# Altium schematic sheet EMG_Sensor_Board.SchDoc: EMG Sensor Board
size A3; Date: 15.05.2024; Author: Robin Geißler; CompanyName: Fraunhofer EMFT; DrawnBy: Robin Geißler; Revision: 1.1.; SheetNumber: 1; SheetTotal: 6
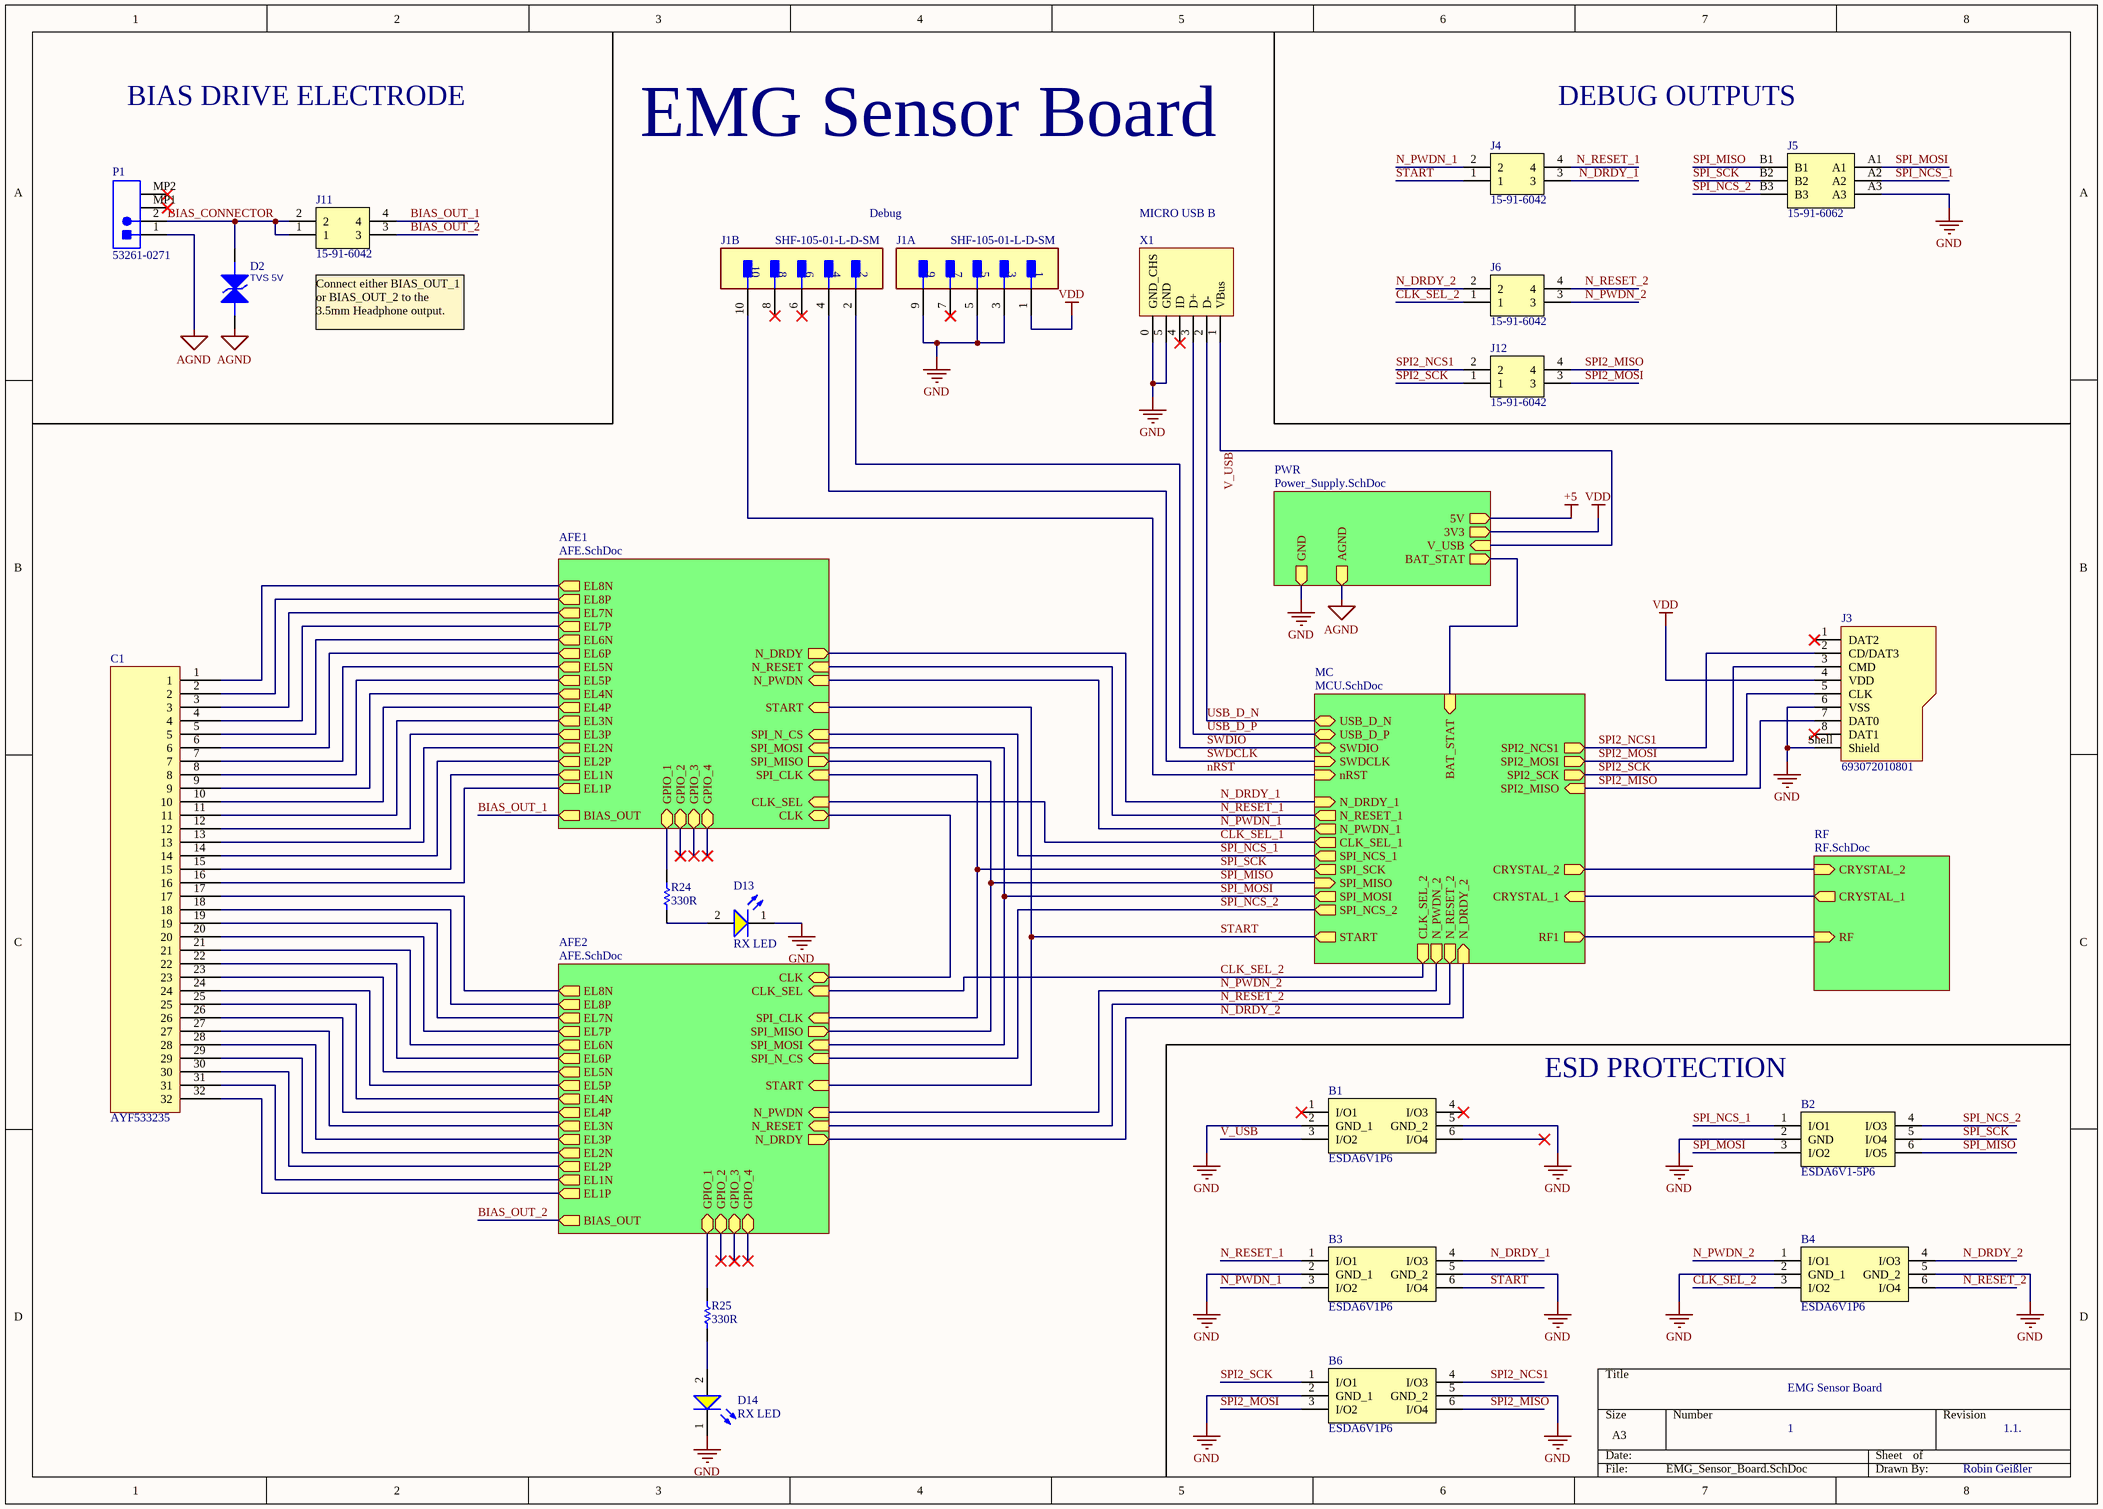
[diagram p0: EMG_Sensor_Board.SchDoc]

## Parts
B1  ESDA6V1P6  [ESDA6V1P6]
B2  ESDA6V1-5P6  [ESDA6V15P6]
B3  ESDA6V1P6  [ESDA6V1P6]
B4  ESDA6V1P6  [ESDA6V1P6]
B6  ESDA6V1P6  [ESDA6V1P6]
C1  AYF533235  [AYF533235]
D2  TVS 5V  [C-1608 [0603]-N]
D13  RX LED  [WL-SMCW_0603_150060xx75000]
D14  RX LED  [WL-SMCW_0603_150060xx75000]
J1  SHF-105-01-L-D-SM  [FP-SHF-105-01-L-D-SM-MFG]  (parts A,B of 2)
J3  693072010801  [693072010801]
J4  15-91-6042  [15916042]
J5  15-91-6062  [15916062]
J6  15-91-6042  [15916042]
J11  15-91-6042  [15916042]
J12  15-91-6042  [15916042]
P1  53261-0271  [MOLX-53261-0271_V]
R24  330R  [RESC1608X55X30LL15T15]
R25  330R  [RESC1608X55X30LL15T15]
X1  MICRO USB B  [Micro USB B]

## Sub-sheets
AFE1 = AFE.SchDoc: SPI_MISO (out), SPI_N_CS (in), SPI_CLK (in), N_DRDY (out), CLK (bidir), CLK_SEL (in), GPIO_1 (bidir), GPIO_2 (bidir), GPIO_3 (bidir), GPIO_4 (bidir), START (in), N_RESET (in), N_PWDN (in), EL1P (out), EL1N (out), EL2P (out), EL2N (out), EL3P (out), EL3N (out), EL4P (out), EL4N (out), EL5P (out), EL5N (out), EL6P (out), EL6N (out), EL7P (out), EL7N (out), EL8P (out), EL8N (out), BIAS_OUT (out), SPI_MOSI (in)
AFE2 = AFE.SchDoc: SPI_MISO (out), SPI_N_CS (in), SPI_CLK (in), N_DRDY (out), CLK (bidir), CLK_SEL (in), GPIO_1 (bidir), GPIO_2 (bidir), GPIO_3 (bidir), GPIO_4 (bidir), START (in), N_RESET (in), N_PWDN (in), EL1P (out), EL1N (out), EL2P (out), EL2N (out), EL3P (out), EL3N (out), EL4P (out), EL4N (out), EL5P (out), EL5N (out), EL6P (out), EL6N (out), EL7P (out), EL7N (out), EL8P (out), EL8N (out), BIAS_OUT (out), SPI_MOSI (in)
MC = MCU.SchDoc: SWDIO (bidir), SWDCLK (in), nRST (in), SPI_SCK (out), SPI_MISO (in), SPI_MOSI (out), SPI_NCS_1 (out), SPI_NCS_2 (out), USB_D_P (bidir), USB_D_N (bidir), RF1 (out), START (out), N_DRDY_1 (in), N_RESET_1 (out), N_PWDN_1 (out), N_DRDY_2 (in), N_RESET_2 (out), N_PWDN_2 (out), CLK_SEL_1 (out), CLK_SEL_2 (out), CRYSTAL_2 (out), CRYSTAL_1 (in), BAT_STAT (in), SPI2_MOSI (out), SPI2_MISO (in), SPI2_SCK (out), SPI2_NCS1 (out)
PWR = Power_Supply.SchDoc: V_USB (in), BAT_STAT (out), 5V (out), 3V3 (out), GND (out), AGND (out)
RF = RF.SchDoc: RF (in), CRYSTAL_1 (out), CRYSTAL_2 (in)

## Nets
+5: sheet PWR/5V
AGND: D2.2(ANODE) P1.1 ; sheet PWR/AGND
GND: B1.2(GND_1) B1.5(GND_2) B2.2(GND) B3.2(GND_1) B3.5(GND_2) B4.2(GND_1) B4.5(GND_2) B6.2(GND_1) B6.5(GND_2) D13.1(K) D14.1(K) J1.3 J1.5 J1.9 J3.6(VSS) J3.Shell(Shield) J5.A3 X1.0(GND_CHS) X1.5(GND) ; sheet PWR/GND
VDD: J1.1 J3.4(VDD) ; sheet PWR/3V3
BIAS_CONNECTOR: D2.1(CATHODE) J11.1 J11.2 P1.2
BIAS_OUT_1: J11.4 ; sheet AFE1/BIAS_OUT
BIAS_OUT_2: J11.3 ; sheet AFE2/BIAS_OUT
CLK_SEL_1: sheet MC/CLK_SEL_1, sheet AFE1/CLK_SEL
CLK_SEL_2: B4.3(I/O2) J6.1 ; sheet MC/CLK_SEL_2, sheet AFE2/CLK_SEL
N_DRDY_1: B3.4(I/O3) J4.3 ; sheet MC/N_DRDY_1, sheet AFE1/N_DRDY
N_DRDY_2: B4.4(I/O3) J6.2 ; sheet MC/N_DRDY_2, sheet AFE2/N_DRDY
N_PWDN_1: B3.3(I/O2) J4.2 ; sheet MC/N_PWDN_1, sheet AFE1/N_PWDN
N_PWDN_2: B4.1(I/O1) J6.3 ; sheet MC/N_PWDN_2, sheet AFE2/N_PWDN
N_RESET_1: B3.1(I/O1) J4.4 ; sheet MC/N_RESET_1, sheet AFE1/N_RESET
N_RESET_2: B4.6(I/O4) J6.4 ; sheet MC/N_RESET_2, sheet AFE2/N_RESET
nRST: J1.10 ; sheet MC/nRST
SPI2_MISO: B6.6(I/O4) J3.7(DAT0) J12.4 ; sheet MC/SPI2_MISO
SPI2_MOSI: B6.3(I/O2) J3.3(CMD) J12.3 ; sheet MC/SPI2_MOSI
SPI2_NCS1: B6.4(I/O3) J3.2(CD/DAT3) J12.2 ; sheet MC/SPI2_NCS1
SPI2_SCK: B6.1(I/O1) J3.5(CLK) J12.1 ; sheet MC/SPI2_SCK
SPI_MISO: B2.6(I/O5) J5.B1 ; sheet MC/SPI_MISO, sheet AFE1/SPI_MISO, sheet AFE2/SPI_MISO
SPI_MOSI: B2.3(I/O2) J5.A1 ; sheet MC/SPI_MOSI, sheet AFE1/SPI_MOSI, sheet AFE2/SPI_MOSI
SPI_NCS_1: B2.1(I/O1) J5.A2 ; sheet MC/SPI_NCS_1, sheet AFE1/SPI_N_CS
SPI_NCS_2: B2.4(I/O3) J5.B3 ; sheet MC/SPI_NCS_2, sheet AFE2/SPI_N_CS
SPI_SCK: B2.5(I/O4) J5.B2 ; sheet MC/SPI_SCK, sheet AFE1/SPI_CLK, sheet AFE2/SPI_CLK
START: B3.6(I/O4) J4.1 ; sheet MC/START, sheet AFE1/START, sheet AFE2/START
SWDCLK: J1.4 ; sheet MC/SWDCLK
SWDIO: J1.2 ; sheet MC/SWDIO
USB_D_N: X1.2(D-) ; sheet MC/USB_D_N
USB_D_P: X1.3(D+) ; sheet MC/USB_D_P
V_USB: B1.3(I/O2) X1.1(VBus) ; sheet PWR/V_USB
NetC1_1: C1.1 ; sheet AFE1/EL8N
NetC1_2: C1.2 ; sheet AFE1/EL8P
NetC1_3: C1.3 ; sheet AFE1/EL7N
NetC1_4: C1.4 ; sheet AFE1/EL7P
NetC1_5: C1.5 ; sheet AFE1/EL6N
NetC1_6: C1.6 ; sheet AFE1/EL6P
NetC1_7: C1.7 ; sheet AFE1/EL5N
NetC1_8: C1.8 ; sheet AFE1/EL5P
NetC1_9: C1.9 ; sheet AFE1/EL4N
NetC1_10: C1.10 ; sheet AFE1/EL4P
NetC1_11: C1.11 ; sheet AFE1/EL3N
NetC1_12: C1.12 ; sheet AFE1/EL3P
NetC1_13: C1.13 ; sheet AFE1/EL2N
NetC1_14: C1.14 ; sheet AFE1/EL2P
NetC1_15: C1.15 ; sheet AFE1/EL1N
NetC1_16: C1.16 ; sheet AFE1/EL1P
NetC1_17: C1.17 ; sheet AFE2/EL8N
NetC1_18: C1.18 ; sheet AFE2/EL8P
NetC1_19: C1.19 ; sheet AFE2/EL7N
NetC1_20: C1.20 ; sheet AFE2/EL7P
NetC1_21: C1.21 ; sheet AFE2/EL6N
NetC1_22: C1.22 ; sheet AFE2/EL6P
NetC1_23: C1.23 ; sheet AFE2/EL5N
NetC1_24: C1.24 ; sheet AFE2/EL5P
NetC1_25: C1.25 ; sheet AFE2/EL4N
NetC1_26: C1.26 ; sheet AFE2/EL4P
NetC1_27: C1.27 ; sheet AFE2/EL3N
NetC1_28: C1.28 ; sheet AFE2/EL3P
NetC1_29: C1.29 ; sheet AFE2/EL2N
NetC1_30: C1.30 ; sheet AFE2/EL2P
NetC1_31: C1.31 ; sheet AFE2/EL1N
NetC1_32: C1.32 ; sheet AFE2/EL1P
NetD13_2: D13.2(A) R24.1
NetD14_2: D14.2(A) R25.2
NetR24_2: R24.2 ; sheet AFE1/GPIO_1
NetR25_1: R25.1 ; sheet AFE2/GPIO_1
(unnamed): sheet MC/RF1, sheet RF/RF
(unnamed): sheet MC/CRYSTAL_2, sheet RF/CRYSTAL_2
(unnamed): sheet MC/CRYSTAL_1, sheet RF/CRYSTAL_1
(unnamed): sheet MC/BAT_STAT, sheet PWR/BAT_STAT
(unnamed): sheet AFE1/CLK, sheet AFE2/CLK

Not connected (* = marked no-connect by the designer): B1 1(I/O1)* 4(I/O3)* 6(I/O4)*; J1 6* 7* 8*; J3 1(DAT2)* 8(DAT1)*; P1 MP1* MP2*; X1 4(ID)*

## Notes on the sheet
- BIAS DRIVE ELECTRODE
- DEBUG OUTPUTS
- EMG Sensor Board
- Debug
- (near J11) Connect either BIAS_OUT_1 or BIAS_OUT_2 to the 3.5mm Headphone output.
- ESD PROTECTION

## Library data of the parts
B1 B3 B4 B6 = ESDA6V1P6: 4 line ESD protection, 6.1 V VBR, in SOT666; Manufacturer_Name: STMicroelectronics; Geometry.Height: 0.62mm; Manufacturer_Part_Number: ESDA6V1P6; Mouser Part Number: 511-ESDA6V1P6; Mouser Price/Stock: https://www.mouser.co.uk/ProductDetail/STMicroelectronics/ESDA6V1P6?qs=ewe0KQ%2FSs5H0%252BSAub%2FR2ag%3D%3D; Arrow Part Number: ESDA6V1P6; Arrow Price/Stock: https://www.arrow.com/en/products/esda6v1p6/stmicroelectronics?region=nac; Datasheet Link: https://www.st.com/resource/en/datasheet/esda14v2bp6.pdf
  B1 B3: Supplier 1: Mouser; Supplier Part Number 1: 511-ESDA6V1P6
B2 = ESDA6V1-5P6: 5 line ESD protection, 6.1 V VBR, in SOT666; Manufacturer_Name: STMicroelectronics; Geometry.Height: 0.62mm; Manufacturer_Part_Number: ESDA6V1-5P6; Mouser Part Number: 511-ESDA6V1-5P6; Mouser Price/Stock: https://www.mouser.co.uk/ProductDetail/STMicroelectronics/ESDA6V1-5P6?qs=at%2FPaO0D8JbsyvB5MtIioA%3D%3D; Arrow Part Number: ESDA6V1-5P6; Arrow Price/Stock: https://www.arrow.com/en/products/esda6v1-5p6/stmicroelectronics?region=nac; Datasheet Link: https://www.st.com/resource/en/datasheet/esda14v2bp6.pdf
D2 = D_TVS_0603_CG0603MLU-05E: ESD-Entstörer/TVS-Dioden CHIP GUARD 5VOLT; Supplier 1 No: 652-CG0603MLU-05E; Supplier 1: Mouser
D13 D14 = CMP-1426-00005-2: NexarPartId: 29687085; Wavelength: 590nm; Luminous Intensity: 120mcd; Peak Wavelength: 595nm; Forward Current: 100mA; Power Dissipation: 72mW; Color: Yellow; Forward Voltage: 2V; Test Current: 20mA; Reverse Voltage: 5V; Lens Style: Clear, Rectangular; Max Junction Temperature (Tj): 95°C; Viewing Angle: 140°; Case Code (Imperial): 0603; Height: 700µm; REACH SVHC: Unknown; Dominant Wavelength: 590nm; Min Operating Temperature: -40°C; Width: 800µm; Mount: Surface Mount; Packaging: Tape and Reel; Max Operating Temperature: 85°C; RoHS: Compliant; Max Reverse Voltage (DC): 5V; Case Code (Metric): 1608; Length: 1.6mm; Case/Package: 0603
J1 = CMP-02766-000087-1: CONN HEADER SMD 10POS 1.27MM; Manufacturer: Samtec; Number Of Contacts: 10; Conn Gender: Male; Conn Orientation: Straight; Automotive: No; Lead Free: Yes; Contact Material: Gold,Nickel; Digikey Description: CONN HEADER SMD 10POS 1.27MM; Device Class L3: unset; Device Class L2: Headers and Wire Housings; RoHS: TRUE; Number Of Rows: 2; Package: SHF-105-01-L-D-SM; Pitch: 1.27mm; Octopart: https://octopart.com/shf-105-01-l-d-sm-samtec-17879411; Temperature Range Low: -55°C; Height: 5.59mm; ComponentLink2Description: Datasheet; Category: Conn; Manufacturer Part Number: SHF-105-01-L-D-SM; Device Class L1: Connectors; Mouser Description: In a Pack of 2, Samtec SHF, 1.27mm Pitch, 10 Way, 2 Row, Straight PCB Header, Surface Mount; Temperature Range High: +125°C; ComponentLink2URL: http://suddendocs.samtec.com/catalog_english/shf.pdf; Footprint Url: http://suddendocs.samtec.com/prints/shf-1xx-01-x-d-xx-xx-footprint.pdf; Temperature: -55°C to +125°C
J3 = CMP-1502-00164-2: NexarPartId: 22866686; Voltage Rating: 100V; Insulation Resistance: 1GΩ; Current Rating: 500mA; Memory Type: FLASH; Number of Positions: 8; Connector Type: Connector; Width: 13.5mm; Number of Pins: 8; REACH SVHC: Unknown; Contact Material: Copper, Gold; Contact Plating: Gold; Max Operating Temperature: 85°C; Color: Black; Operating Supply Voltage: 100V; Packaging: Tape and Reel; RoHS: Compliant; Height: 1.75mm; Number of Contacts: 8; Mount: Surface Mount; Length: 14.5mm; Min Operating Temperature: -25°C
J4 J6 J11 J12 = 15-91-6042: 2.54mm Pitch SL Wire-to-Board Header, Low Profile, Surface Mount, Single Row, Right-Angle, 3.05mm Pocket, Shrouded, with Press-fit Plastic Peg,  Circuits, Tin (Sn) Plating, Embossed Tape Packaging; Manufacturer_Name: Molex; Geometry.Height: 11.69mm; Manufacturer_Part_Number: 15-91-6042; Mouser Part Number: 538-15-91-6042; Mouser Price/Stock: https://www.mouser.co.uk/ProductDetail/Molex/15-91-6042?qs=3DzawVMofg8HeBuyct9LCA%3D%3D; Arrow Part Number: *; Arrow Price/Stock: *; Datasheet Link: https://componentsearchengine.com/Datasheets/1/15-91-6042.pdf
J5 = 15-91-6062: 2.54mm Pitch SL Wire-to-Board Header, Low Profile, Surface Mount, Single Row, Right-Angle, 3.05mm Pocket, Shrouded, with Press-fit Plastic Peg,  Circuits, Tin (Sn) Plating, Embossed Tape Packaging; Manufacturer_Name: Molex; Geometry.Height: 9.91mm; Manufacturer_Part_Number: 15-91-6062; Mouser Part Number: 538-15-91-6062; Mouser Price/Stock: https://www.mouser.co.uk/ProductDetail/Molex/15-91-6062?qs=Wx%252BBqzKDvcssfuSpK%2FN0NQ%3D%3D; Arrow Part Number: *; Arrow Price/Stock: *; Datasheet Link: https://www.molex.com/content/dam/molex/molex-dot-com/products/automated/en-us/salesdrawingpdf/713/71308/015916062_sd.pdf
P1 = CMP-2000-05633-1: PicoBlade(TM) Header, Right Angle, -40 to 85 degC, 2-Pin SMD, RoHS, Tape and Reel; Current - Max: 1A; Brand: Molex; Voltage Rating: 125V; Number of Positions: 2; Pitch: 1.25mm; Package Version: Rev. H, 11/2014; Factory Pack Quantity: 1000; Datasheet URL: http://www.molex.com/webdocs/datasheets/pdf/en-us/0532610271_PCB_HEADERS.pdf; Datasheet Version: 03/2016; Housing Material: Thermoplastic; RoHS: Details; Product Type: Headers; Number of Rows: 1; Termination Style: SMD; Mounting Technology: SurfaceMount; Number of Positions / Contacts: 2; Package URL: http://www.molex.com/pdm_docs/sd/532610271_sd.pdf; Mounting Angle: Right; Mounting Style: SMD/SMT; Manufacturer: Molex; Product Category: 1.25mmConnectors; Tradename: PicoBlade; Voltage - Max: 125V; Manufacturer URL: http://www.molex.com/; Series: 53261; Package Description: 2-Leads Header, Pitch 1.25 mm, Mated Height 3.4 mm; Package Reference: 53261-0271; Current Rating: 1A; Contact Plating: Tin; Contact Material: PhosphorBronze; Type: Shrouded; Packaging: Reel
R24 R25 = CMP-2000-00435-2: Chip Resistor, 330 Ohm, +/- 1%, 0.1 W, -55 to 155 degC, 0603 (1608 Metric), RoHS, Tape and Reel; Gender: Male; Mating Cycles: 10000; Current Rating: 500 mA; Voltage Rating: 10 V; REACH SVHC: No SVHC; PackageDescription: 2-Pin Surface Mount Device, Body 1.6 x 0.85 mm; Contact Finish: Gold; Pins: 8; ComponentLink1Description: Manufacturer URL; Packaging: Tape and Reel; Max Operating Temperature: 85 degC; Contact Material: Copper; Height: 1.45 mm; Width: 1.45 mm; DatasheetVersion: Apr-15; Package Quantity: 1500; Contact Plating: Gold; PackageReference: 0603; Mount: Surface Mount; Lead Pitch: 1.1 mm; Min Operating Temperature: -25 degC; ComponentLink1URL: http://www.panasonic.com/; ComponentLink2URL: http://industrial.panasonic.com/cdbs/www-data/pdf/RDA0000/AOA0000C86.pdf; Length: 13.7 mm; ComponentLink2Description: Datasheet; RoHSCompliant: true
X1 = MICRO USB B: MICRO USB B Molex; Supplier 1: Mouser; Supplier Part Number 1: 538-47346-0001